# EasyEDA schematic SCH_ProbeConverter_2023-01-18 (1).json
TITLE: Sheet_1; REV: 1.0; Date: 2023-01-18; Sheet: 1/1; Drawn By: Willy Schütze; Company: InMachines Ingrassia GmbH
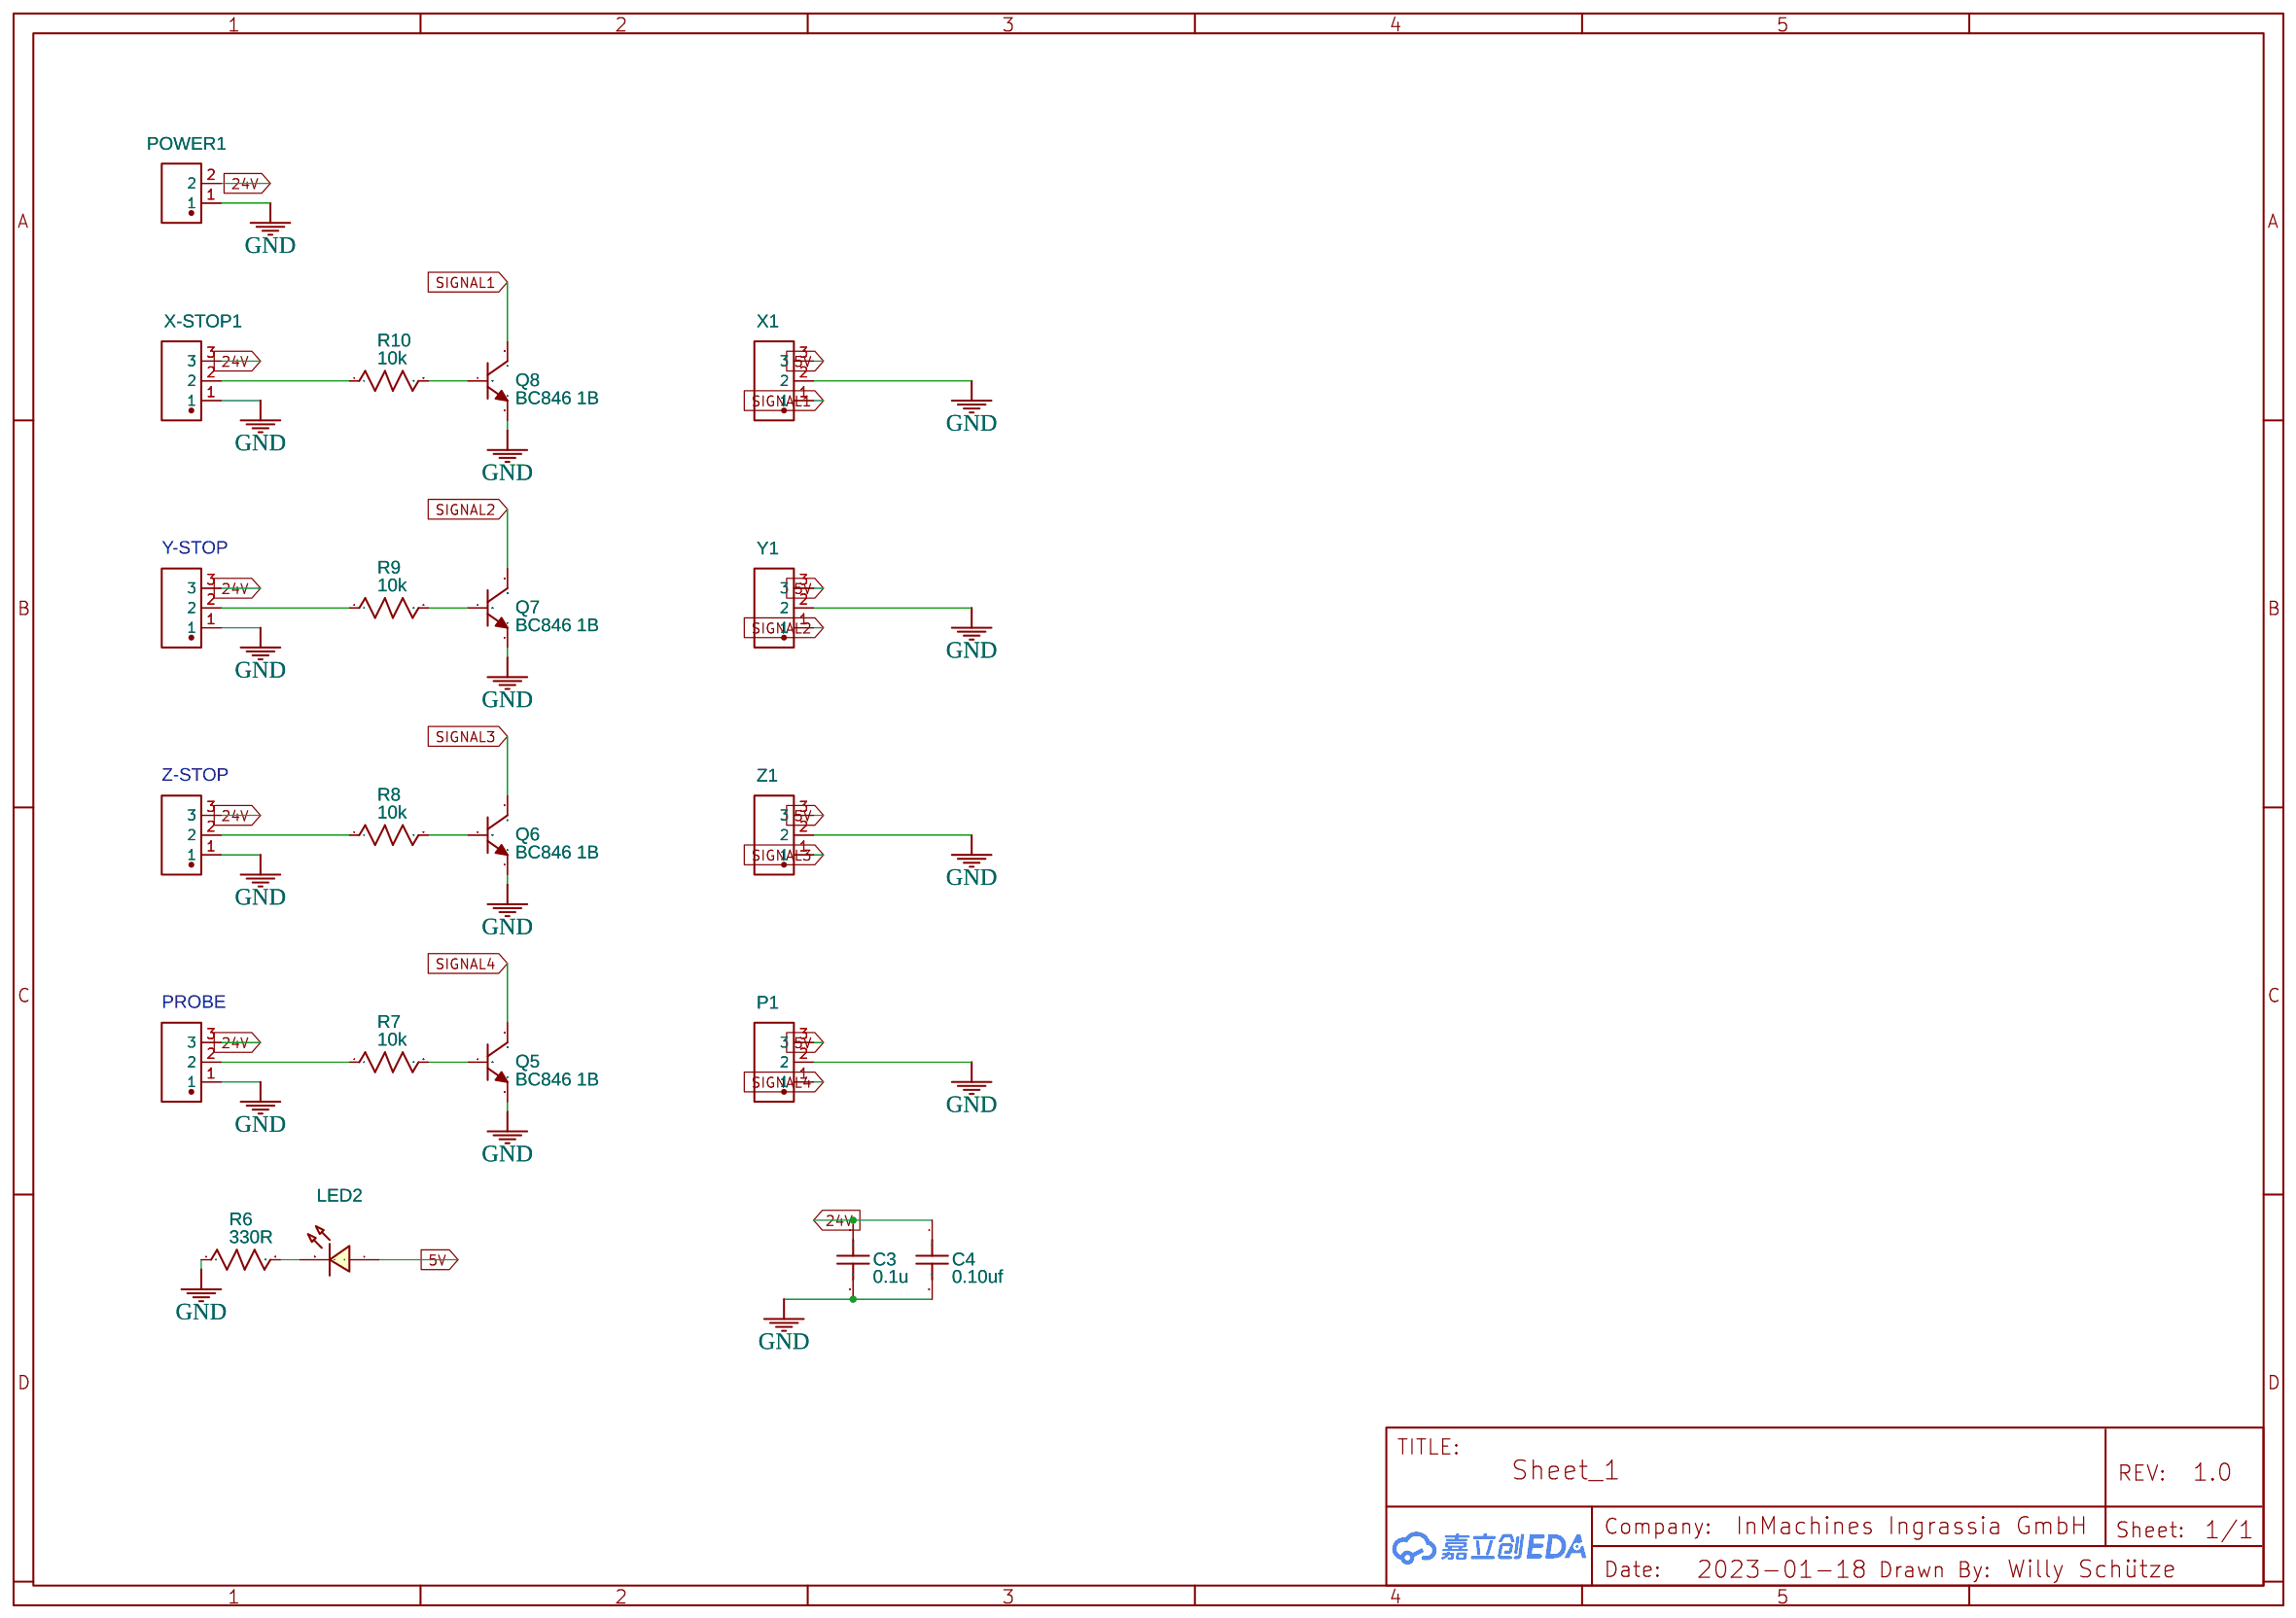
[diagram p0: schematic sheet]

## Parts
C3  0.1u  [C1206]
C4  0.10uf  [C1206]
LED2  SZYY1206G  [LED1206-R-RD]
P1  KF2EDGR-5.08-3P  [CONN-TH_3P-P5.08_KF2EDGR-5.08-3P]
POWER1  KF2EDGR-5.08-2P  [CONN-TH_2P-P5.08_KF2EDGR-5.08-2P]
PROBE1  KF2EDGR-5.08-3P  [CONN-TH_3P-P5.08_KF2EDGR-5.08-3P]
Q5  BC846 1B  [SOT-23-3_L2.9-W1.6-P1.90-LS2.8-BR]
Q6  BC846 1B  [SOT-23-3_L2.9-W1.6-P1.90-LS2.8-BR]
Q7  BC846 1B  [SOT-23-3_L2.9-W1.6-P1.90-LS2.8-BR]
Q8  BC846 1B  [SOT-23-3_L2.9-W1.6-P1.90-LS2.8-BR]
R6  330R  [R1206]
R7  10k  [R1206]
R8  10k  [R1206]
R9  10k  [R1206]
R10  10k  [R1206]
X1  KF2EDGR-5.08-3P  [CONN-TH_3P-P5.08_KF2EDGR-5.08-3P]
X-STOP1  KF2EDGR-5.08-3P  [CONN-TH_3P-P5.08_KF2EDGR-5.08-3P]
Y1  KF2EDGR-5.08-3P  [CONN-TH_3P-P5.08_KF2EDGR-5.08-3P]
Y-STOP1  KF2EDGR-5.08-3P  [CONN-TH_3P-P5.08_KF2EDGR-5.08-3P]
Z1  KF2EDGR-5.08-3P  [CONN-TH_3P-P5.08_KF2EDGR-5.08-3P]
Z-STOP1  KF2EDGR-5.08-3P  [CONN-TH_3P-P5.08_KF2EDGR-5.08-3P]

## Library data of the parts
C3 C4 = C_1206_US: Contributor: LCEDA_Lib
LED2 = SZYY1206G: Supplier: LCSC; Supplier Part: C434439; Manufacturer: Yongyu Photoelectric; Contributor: LCSC; JLCPCB Part Class: Extended Part
P1 PROBE1 X1 X-STOP1 Y1 Y-STOP1 Z1 Z-STOP1 = KF2EDGR-5.08-3P: Supplier: LCSC; Supplier Part: C441205; Manufacturer: Cixi Kefa Elec; Contributor: LCSC; JLCPCB Part Class: Extended Part
POWER1 = KF2EDGR-5.08-2P: Supplier: LCSC; Supplier Part: C441204; Manufacturer: Cixi Kefa Elec; Contributor: LCSC; JLCPCB Part Class: Extended Part
Q5-Q8 = BC846 1B: Supplier: LCSC; Manufacturer: CJ; Supplier Part: C8573; JLCPCB Part Class: Extended Part
R6-R10 = R_1206_US: Contributor: LCEDA_Lib

## Nets
5V: LED2.1(+) P1.3 X1.3 Y1.3 Z1.3
24V: C3.1 C4.1 POWER1.2 PROBE1.3 X-STOP1.3 Y-STOP1.3 Z-STOP1.3
GND: C3.2 C4.2 P1.2 POWER1.1 PROBE1.1 Q5.2(E) Q6.2(E) Q7.2(E) Q8.2(E) R6.1 X1.2 X-STOP1.1 Y1.2 Y-STOP1.1 Z1.2 Z-STOP1.1
SIGNAL1: Q8.3(C) X1.1
SIGNAL2: Q7.3(C) Y1.1
SIGNAL3: Q6.3(C) Z1.1
SIGNAL4: P1.1 Q5.3(C)
Net-(LED2-2): LED2.2(-) R6.2
Net-(PROBE1-2): PROBE1.2 R7.1
Net-(Q5-1): Q5.1(B) R7.2
Net-(Q6-1): Q6.1(B) R8.2
Net-(Q7-1): Q7.1(B) R9.2
Net-(Q8-1): Q8.1(B) R10.2
Net-(R8-1): R8.1 Z-STOP1.2
Net-(R9-1): R9.1 Y-STOP1.2
Net-(R10-1): R10.1 X-STOP1.2

## Notes on the sheet
- Y-STOP
- Z-STOP
- PROBE
